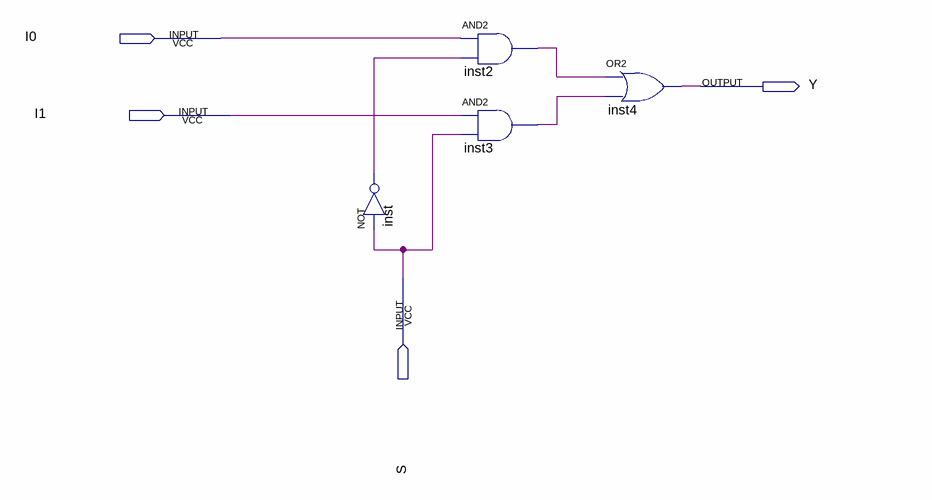
[diagram p0: schematic sheet]
// Quartus schematic Mux2_1.bdf as structural Verilog: 4 symbols, 4 pins
module Mux2_1 (
  input  I0,
  input  I1,
  input  S,
  output Y
);

  wire inst2_out, inst3_out, inst_out;

  not inst (inst_out, S);
  and inst2 (inst2_out, I0, inst_out);
  and inst3 (inst3_out, I1, S);
  or inst4 (Y, inst2_out, inst3_out);
endmodule
